# Altium schematic sheet MAIN.SchDoc
size A4; Engineer: Alisya K.; Organization: ORGANIZATION; Address1: ADDRESS 1; Address2: ADDRESS 2; Address3: ADDRESS 3; Address4: ADDRESS 4; Revision: -; SheetNumber: 1; SheetTotal: 1; Project: FM Radio Bug; ENG_APP_DATE: --/--/--; DSN_APP_DATE: --/--/--; CHK_APP_DATE: --/--/--; SchTitle: MAIN; SchBrief: FM transmitter, can be tuned between the range of 88 MHz to 108 MHz.
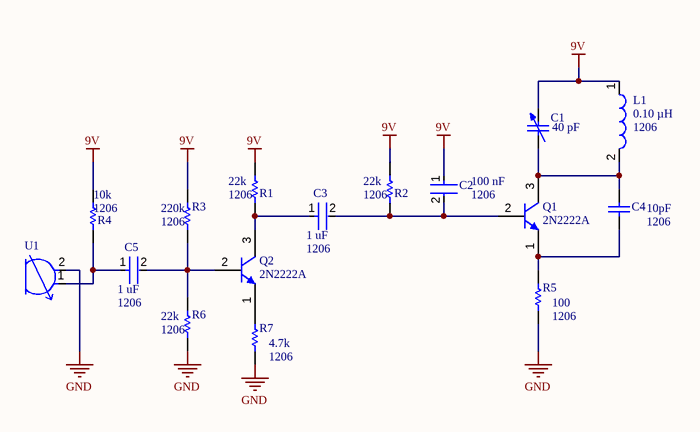
[diagram p0: MAIN.SchDoc]

## Parts
C1  TZ03R300F169B00  [MURA-TZ03-2_V]  (value not drawn)
C2  value 100 nF  Package: 1206  [FP-C1206C-EB-MFG]  (hidden comment: C1206C103K2RACTU)
C3  value 1 uF  Package: 1206  [FP-CC1206-1_25-MFG]  (hidden comment: CC1206KRX7R9BB104)
C4  value 10pF  Case-EIA: 1206  [CAPC1206(3216)170_M]  (hidden comment: CAP 4.7pF 50V 1206(3216))
C5  value 1 uF  Package: 1206  [FP-CC1206-1_25-MFG]  (hidden comment: CC1206KRX7R9BB104)
L1  Inductance: 0.10 µH  PackageReference: 1206  [SMD-1210]  (hidden comment: 7447912)
Q1  2N2222A  [FAIR-TO-92]
Q2  2N2222A  [FAIR-TO-92]
R1  CRCW120610K0FKEAHP  [RESC3116X65X50NL20T20]  (value not drawn)
R2  CRCW120610K0FKEAHP  [RESC3116X65X50NL20T20]  (value not drawn)
R3  RT1206BRD071ML  [RESC3116X65X40ML10T20]  (value not drawn)
R4  CRCW120610K0FKEAHP  [RESC3116X65X50NL20T20]  (value not drawn)
R5  ERJ-8ENF1001V  [RESC3216X70X50LL05T20]  (value not drawn)
R6  CRCW1206100KFKEA  [RESC3216X60X45NL10T20]  (value not drawn)
R7  ERJ-P08J101V  [RESC3216X70X50LL05T20]  (value not drawn)
U1  POM-3535P-3-R  [FP-POM-3535P-3-R-MFG]  (value not drawn)

## Nets
9V: C1.2 C2.1 L1.1 R1.2 R2.2 R3.2 R4.2
GND: R5.1 R6.1 R7.1 U1.2(C)
NetC1_1: C1.1 C4.2 L1.2 Q1.3(C)
NetC2_2: C2.2 C3.2 Q1.2(B) R2.1
NetC3_1: C3.1 Q2.3(C) R1.1
NetC4_1: C4.1 Q1.1(E) R5.2
NetC5_1: C5.1 R4.1 U1.1(A)
NetC5_2: C5.2 Q2.2(B) R3.1 R6.2
NetQ2_1: Q2.1(E) R7.2

## Notes on the sheet
- (near C1) 40 pF
- (near R4) 10k
- (near R4) 1206
- (near R3) 220k
- (near R3) 1206
- (near R1) 22k
- (near R1) 1206
- (near R2) 22k
- (near R2) 1206
- (near R6) 22k
- (near R6) 1206
- (near R7) 4.7k
- (near R7) 1206
- (near R5) 1206
- (near R5) 100
- DOCUMENT
- PROJECT
- MODIFIED
- REVISION
- ENGINEER
- REVIEWER
- SHEET #

## Library data of the parts
C1 = CMP-2000-07339-1: Variable Capacitor, Miniature Ceramic Trimmer, Green, 30 pF, -25 to 85 degC, 2-Pin THD, Bulk; Manufacturer: Murata; Dielectric: N750; Capacitance: 5.2to30pF; Tolerance (%): 0to50%; Rated Voltage: 100V; Datasheet URL: https://datasheet.ciiva.com/29339/12-0130e-29339940.pdf; Mounting Technology: ThroughHole; Manufacturer URL: http://www.murata.com/; Package Reference: TZ03; Case Size/Dimension: 6x6x4.8mm; Datasheet Version: Rev. A, 04/2003; Package Description: 2-Pin Through Hole Device, Dia 6 mm, Body Length 4.8 mm
C2 = CMP-1037-03529-2: CAP CER 10000PF 200V X7R 1206; Manufacturer: KEMET; Automotive Grade: Grade 0; Temperature Coefficient: 15%; Capacitance: 10,000 pF; Material: Ceramic; Tolerance: 0.1; Temperature Range High: +150°C; Category: Cap; Device Class L2: Capacitors; Temperature Range Low: -55°C; Temperature Characteristic: X7R; Lead Free: Yes; Octopart: https://octopart.com/c1206c103k2ractu-kemet-2299149; Device Class L1: Passive Components; RoHS: TRUE; Mouser Description: Multilayer Ceramic Capacitors MLCC - SMD/SMT 200volts 10000pF X7R 10%; Temperature: -55°C to +150°C; Voltage Rating: 200 V; ComponentLink2URL: https://content.kemet.com/datasheets/KEM_C1007_X8R_ULTRA_150C_SMD.pdf; Ipc Land Pattern Name: CAPC320160X78; Automotive: Yes; Device Class L3: Ceramic Capacitors; Manufacturer Part Number: C1206C103K2RACTU; Digikey Description: CAP CER 10000PF 200V X7R 1206; ComponentLink2Description: Datasheet; Height: 0.88mm
C3 C5 = CMP-03422-000842-1: CAP CER 0.1UF 50V X7R 1206; Manufacturer: Yageo; Automotive Grade: NA; Tolerance: 0.1; Material: Ceramic; Temperature Coefficient: 15%; Capacitance: 100 nF; Temperature Characteristic: X7R; Device Class L1: Passive Components; Lead Free: Yes; Octopart: https://octopart.com/cc1206krx7r9bb104-yageo-39467816; Category: Cap; Temperature Range Low: -55°C; Device Class L3: Ceramic Capacitors; Voltage Rating: 50 V; Temperature Range High: +125°C; Device Class L2: Capacitors; RoHS: TRUE; Footprint Url: http://www.yageo.com/exep/pages/download/literatures/UPY-C_GEN_24.pdf; ComponentLink2Description: Datasheet; Temperature: -55°C to +125°C; Digikey Description: CAP CER 0.1UF 50V X7R 1206; Height: 1.45mm; Automotive: No; Mouser Description: Multilayer Ceramic Capacitors MLCC - SMD/SMT 100nF 50V X7R 10%; ComponentLink2URL: http://www.yageo.com/documents/recent/UPY-NP0X7R_HV_1KV-to-3KV_11.pdf; Manufacturer Part Number: CC1206KRX7R9BB104
C4 = CMP-1037-00382-1: Tolerance: Â±0.25pF; Case-Metric: 3216; Rated Voltage: 50 V; Max Thickness: 1.7 mm; Technology: SMT
L1 = CMP-0221-00034-1: SMD-Multilayer Inductor WE-MI, L = 0.10 µH; ComponentLink1Description: Manufacturer Link; DatasheetVersion: ver 5, Oct-2004; PackageVersion: 2007; ComponentLink2URL: http://www.we-online.de/katalog/media/pdf/7447912.pdf; PackageDescription: Chip Inductor, 2-Leads, Body 3.2 x 2.5 mm; ComponentLink2Description: Datasheet; ComponentLink1URL: http://www.we-online.com
Q1 Q2 = CMP-2000-04944-1: NPN General-Purpose Amplifier, 40 V VCEO, 0.2 A, -55 to 150 degC, 2-Pin TO-92, RoHS, Bulk; Manufacturer: FairchildSemiconductor; Maximum Collector Base Voltage: 60V; Minimum DC Current Gain: 40@0.1mA@1V; Maximum Collector Emitter Voltage: 40V; Maximum DC Collector Current: 0.2A; Rad Hard: No; Maximum Operating Frequency: 300(Min)MHz; Maximum Collector Emitter Saturation Voltage: 0.2@1mA@10mA; Maximum Power Dissipation: 625mW; Package Description: 3-Pin Transistor Outline Package, Body Dia 4.79 mm, Pitch 1.27 mm; Package Reference: TO-92; Pin Count: 3; Operating Temperature: -55to150degC; Category: GPBJT; Manufacturer URL: https://www.fairchildsemi.com/; Datasheet URL: https://datasheet.ciiva.com/4722/2n3904-82270-4722369.pdf; Package: 3TO-92; Packaging: Bulk; Type: NPN; Datasheet Version: Rev. 1.1.0, 10/2014; Mounting: ThroughHole
R1 R2 R4 = CMP-2003-04883-1: Manufacturer: Vishay Dale; Part Number: CRCW120610K0FKEAHP
R3 = CMP-2003-04285-1: Manufacturer: Yageo; Part Number: RT1206BRD071ML
R5 = CMP-2003-00017-1: Manufacturer: Panasonic; Part Number: ERJ-8ENF1001V
R6 = CMP-1014-00736-2: Manufacturer: Vishay Dale; Part Number: CRCW1206100KFKEA
R7 = CMP-2003-00713-1: Manufacturer: Panasonic; Part Number: ERJ-P08J101V
U1 = CMP-231723-000001-1: MIC COND ANALOG OMNI -35DB 6MM D; Resistance: 2200R; Direction: Omnidirectional; Impedance: 2.2kR; Shape: Round; Voltage Rating: 2V; Operating Supply Current: 500uA; Packaging: Bulk; Height: 3.7mm; Termination: PC Pins; Depth: 3.7mm; Diameter: 6mm; Mount: Through Hole; Package Quantity: 100; Output Type: Analog